# EAGLE schematic MotionDetectorCamera-Rev4 (EAGLE 9.6.2)

## Sheet 1 of 9: VDD
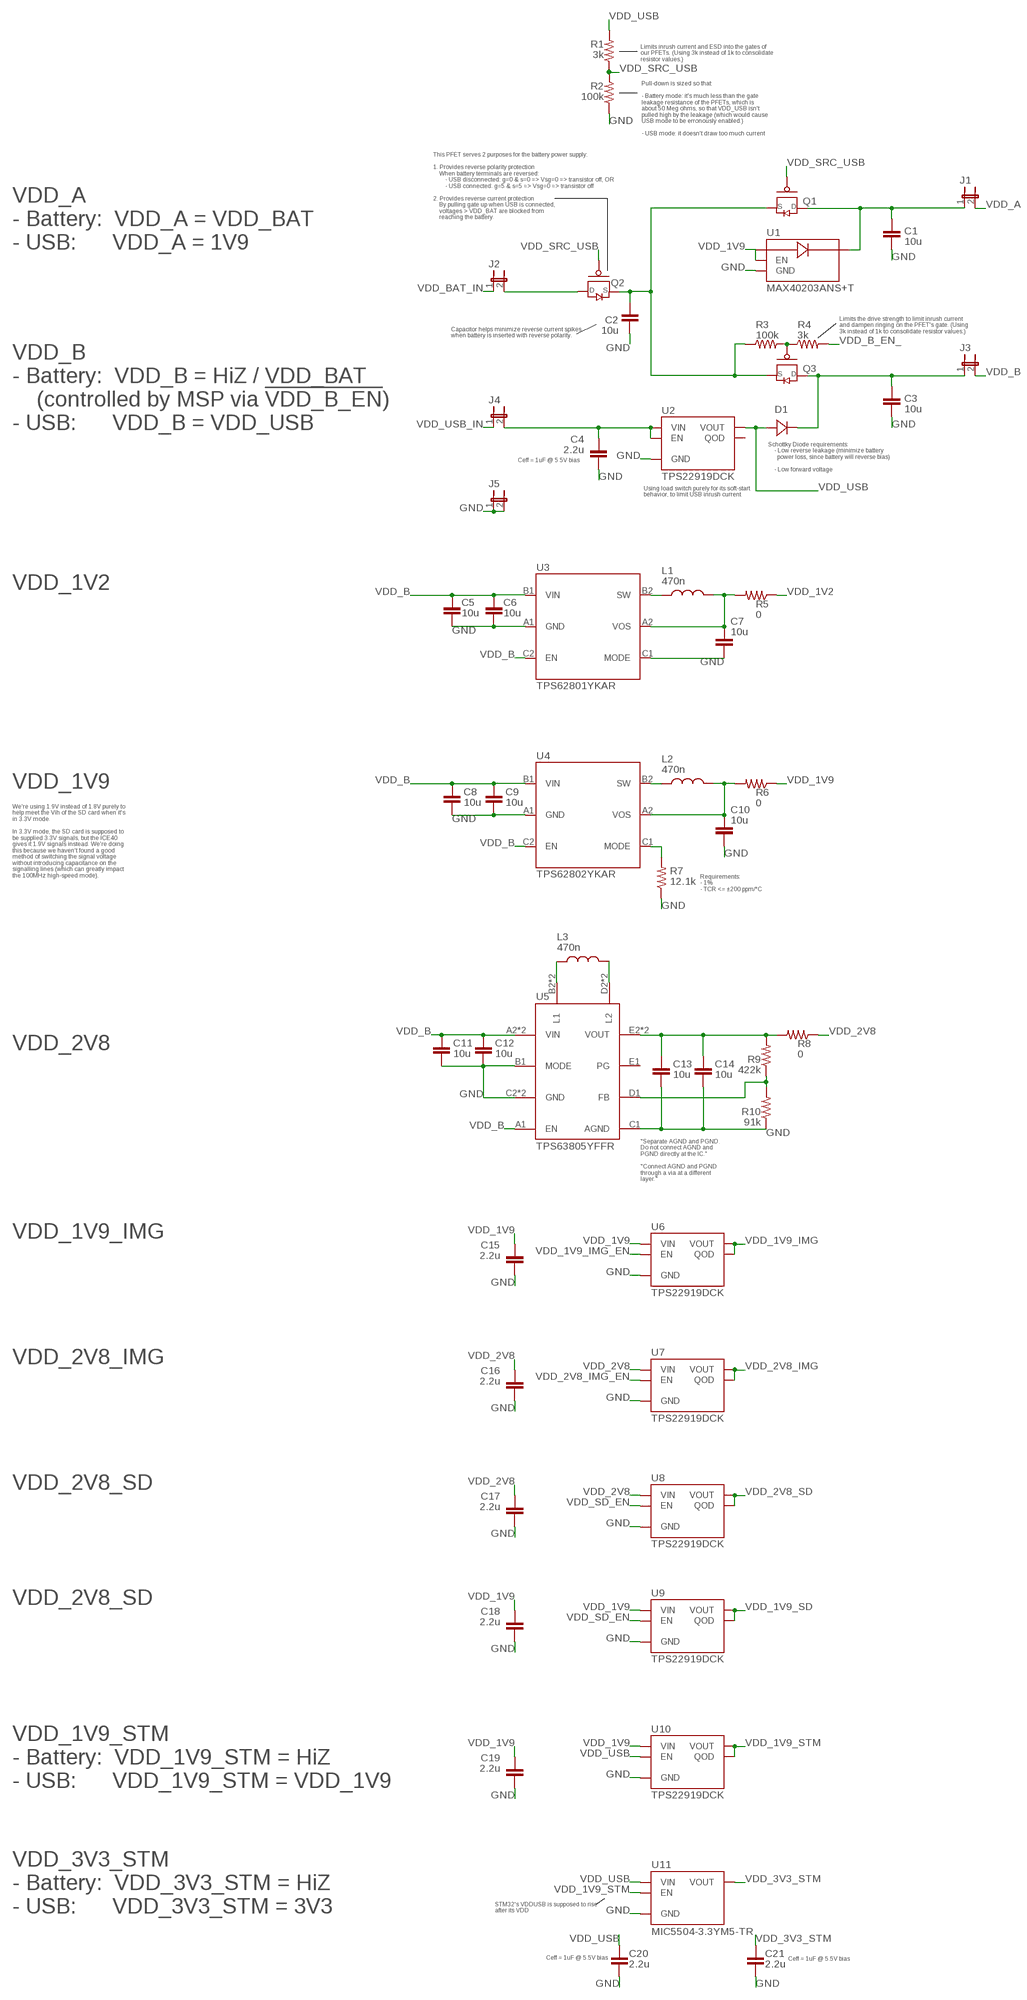
[diagram p0: schematic, sheet 1]

### Parts
C1  10u  CAPACITOR0805  [0805]
C2  10u  CAPACITOR0805  [0805]
C3  10u  CAPACITOR0805  [0805]
C4  2.2u  CAPACITOR0402  [0402]
C5  10u  CAPACITOR0805  [0805]
C6  10u  CAPACITOR0805  [0805]
C7  10u  CAPACITOR0805  [0805]
C8  10u  CAPACITOR0805  [0805]
C9  10u  CAPACITOR0805  [0805]
C10  10u  CAPACITOR0805  [0805]
C11  10u  CAPACITOR0805  [0805]
C12  10u  CAPACITOR0805  [0805]
C13  10u  CAPACITOR0805  [0805]
C14  10u  CAPACITOR0805  [0805]
C15  2.2u  CAPACITOR0402  [0402]
C16  2.2u  CAPACITOR0402  [0402]
C17  2.2u  CAPACITOR0402  [0402]
C18  2.2u  CAPACITOR0402  [0402]
C19  2.2u  CAPACITOR0402  [0402]
C20  2.2u  CAPACITOR0402  [0402]
C21  2.2u  CAPACITOR0402  [0402]
D1  ROHM-RB168MM-40TFTR  [ROHM-RB168MM-40TFTR]
J1  JUMPER  [AMPHENOL-10129380-902002ALF]
J2  JUMPER  [AMPHENOL-10129380-902002ALF]
J3  JUMPER  [AMPHENOL-10129380-902002ALF]
J4  JUMPER  [AMPHENOL-10129380-902002ALF]
J5  JUMPER  [AMPHENOL-10129380-902002ALF]
L1  470n  INDUCTOR0806  [0806]
L2  470n  INDUCTOR0806  [0806]
L3  470n  INDUCTOR0806  [0806]
Q1  PMOS-NEXPERIA-SOT1220  [NEXPERIA-SOT1220]
Q2  PMOS-NEXPERIA-SOT1220  [NEXPERIA-SOT1220]
Q3  PMOS-NEXPERIA-SOT1220  [NEXPERIA-SOT1220]
R1  3k  RESISTOR0402  [0402]
R2  100k  RESISTOR0402  [0402]
R3  100k  RESISTOR0402  [0402]
R4  3k  RESISTOR0402  [0402]
R5  0  RESISTOR0805  [0805]
R6  0  RESISTOR0805  [0805]
R7  12.1k  RESISTOR0402  [0402]
R8  0  RESISTOR0805  [0805]
R9  422k  RESISTOR0402  [0402]
R10  91k  RESISTOR0402  [0402]
U1  MAXIM-MAX40203ANS+T  [MAXIM-MAX40203ANS+T]
U2  TI-TPS22919DCK  [TI-TPS22919DCK]
U3  TI-TPS6280XYKAR  [TI-TPS6280XYKAR]
U4  TI-TPS6280XYKAR  [TI-TPS6280XYKAR]
U5  TI-TPS63805YFFR  [TI-TPS63805YFFR]
U6  TI-TPS22919DCK  [TI-TPS22919DCK]
U7  TI-TPS22919DCK  [TI-TPS22919DCK]
U8  TI-TPS22919DCK  [TI-TPS22919DCK]
U9  TI-TPS22919DCK  [TI-TPS22919DCK]
U10  TI-TPS22919DCK  [TI-TPS22919DCK]
U11  MICROCHIP-MIC550X  [MICROCHIP-MIC550X-SOT23-5]

### Nets
GND: C1.2 C2.2 C3.2 C4.2 C5.2 C6.2 C7.2 C8.2 C9.2 C10.2 C11.2 C12.2 C13.2 C14.2 C15.2 C16.2 C17.2 C18.2 C19.2 C20.2 C21.2 J5.1 J5.2 R2.1 R7.1 R10.1 U1.B2(GND) U2.2(GND) U3.A1(GND) U3.C1(MODE) U4.A1(GND) U5.B1(MODE) U5.C1(AGND) U5.C2(GND) U5.C3(GND) U6.2(GND) U7.2(GND) U8.2(GND) U9.2(GND) U10.2(GND) U11.2(GND) ; also sheet 2,3,4,5,6,7,8,9
N$1: J2.2 Q2.1(D) Q2.2(D) Q2.5(D) Q2.6(D) Q2.7(D)
N$4: L2.1 U4.B2(SW)
N$5: L1.1 U3.B2(SW)
N$6: Q3.3(G) R3.2 R4.1
N$8: C10.1 L2.2 R6.2 U4.A2(VOS)
N$9: C1.1 J1.1 Q1.1(D) Q1.2(D) Q1.5(D) Q1.6(D) Q1.7(D) U1.A2(VOUT)
N$11: R9.1 R10.2 U5.D1(FB)
N$12: L3.1 U5.B2(L1) U5.B3(L1)
N$13: L3.2 U5.D2(L2) U5.D3(L2)
N$15: C3.1 D1.2(C) J3.1 Q3.1(D) Q3.2(D) Q3.5(D) Q3.6(D) Q3.7(D)
N$16: C7.1 L1.2 R5.2 U3.A2(VOS)
N$18: C13.1 C14.1 R8.2 R9.2 U5.E2(VOUT) U5.E3(VOUT)
N$19: C2.1 Q1.4(S) Q1.8(S) Q2.4(S) Q2.8(S) Q3.4(S) Q3.8(S) R3.1
N$21: R7.2 U4.C1(MODE)
N$24: C4.1 J4.2 U2.1(VIN) U2.3(EN)
VDD_1V2: R5.1 ; also sheet 4
VDD_1V9: C15.1 C18.1 C19.1 R6.1 U1.A1(VIN) U1.B1(EN) U6.1(VIN) U9.1(VIN) U10.1(VIN) ; also sheet 2,4,6
VDD_1V9_IMG: U6.5(QOD) U6.6(VOUT) ; also sheet 5
VDD_1V9_IMG_EN: U6.3(EN) ; also sheet 2
VDD_1V9_SD: U9.5(QOD) U9.6(VOUT) ; also sheet 7
VDD_1V9_STM: U10.5(QOD) U10.6(VOUT) U11.3(EN) ; also sheet 8
VDD_2V8: C16.1 C17.1 R8.1 U7.1(VIN) U8.1(VIN) ; also sheet 4
VDD_2V8_IMG: U7.5(QOD) U7.6(VOUT) ; also sheet 5
VDD_2V8_IMG_EN: U7.3(EN) ; also sheet 2
VDD_2V8_SD: U8.5(QOD) U8.6(VOUT) ; also sheet 7
VDD_3V3_STM: C21.1 U11.5(VOUT) ; also sheet 8
VDD_A: J1.2 ; also sheet 2,3
VDD_B: C5.1 C6.1 C8.1 C9.1 C11.1 C12.1 J3.2 U3.B1(VIN) U3.C2(EN) U4.B1(VIN) U4.C2(EN) U5.A1(EN) U5.A2(VIN) U5.A3(VIN)
VDD_B_EN_: R4.2 ; also sheet 2
VDD_BAT_IN: J2.1
VDD_SD_EN: U8.3(EN) U9.3(EN) ; also sheet 2
VDD_SRC_USB: Q1.3(G) Q2.3(G) R1.1 R2.2
VDD_USB: C20.1 D1.1(A) R1.2 U2.6(VOUT) U10.3(EN) U11.1(VIN)
VDD_USB_IN: J4.1 ; also sheet 8,9
Unconnected: U2.5(QOD) U5.E1(PG)

### Notes on the sheet
- Limits inrush current and ESD into the gates of
  our PFETs. (Using 3k instead of 1k to consolidate
  resistor values.)
- Pull-down is sized so that:
  
  - Battery mode: it's much less than the gate
  leakage resistance of the PFETs, which is
  about 50 Meg ohms, so that VDD_USB isn't
  pulled high by the leakage (which would cause
  USB mode to be erronously enabled.)
  
  - USB mode: it doesn't draw too much current
- This PFET serves 2 purposes for the battery power supply:
  
  1. Provides reverse polarity protection
      When battery terminals are reversed:
          - USB disconnected: g=0 & s=0 => Vsg=0 => transistor off, OR
          - USB connected: g=5 & s=5 => Vsg=0 => transistor off
  
  2. Provides reverse current protection
      By pulling gate up when USB is connected,
      voltages > VDD_BAT are blocked from
      reaching the battery.
- VDD_A
  - Battery:  VDD_A = VDD_BAT
  - USB:      VDD_A = 1V9
- Limits the drive strength to limit inrush current
  and dampen ringing on the PFET's gate. (Using
  3k instead of 1k to consolidate resistor values.)
- Capacitor helps minimize reverse current spikes
  when battery is inserted with reverse polarity.
- VDD_B
  - Battery:  VDD_B = HiZ / VDD_BAT
      (controlled by MSP via !VDD_B_EN!)
  - USB:      VDD_B = VDD_USB
- Schottky Diode requirements:
      - Low reverse leakage (minimize battery
        power loss, since battery will reverse bias)
  
      - Low forward voltage
- Ceff = 1uF @ 5.5V bias
- Using load switch purely for its soft-start
  behavior, to limit USB inrush current
- VDD_1V2
- VDD_1V9
- We're using 1.9V instead of 1.8V purely to
  help meet the Vih of the SD card when it's
  in 3.3V mode.
  
  In 3.3V mode, the SD card is supposed to
  be supplied 3.3V signals, but the ICE40
  gives it 1.9V signals instead. We're doing
  this because we haven't found a good
  method of switching the signal voltage
  without introducing capacitance on the
  signalling lines (which can greatly impact
  the 100MHz high-speed mode).
- Requirements:
  - 1%
  - TCR <= ±200 ppm/°C
- VDD_2V8
- "Separate AGND and PGND.
  Do not connect AGND and
  PGND directly at the IC."
  
  "Connect AGND and PGND
  through a via at a different
  layer."
- VDD_1V9_IMG
- VDD_2V8_IMG
- VDD_2V8_SD
- VDD_2V8_SD
- VDD_1V9_STM
  - Battery:  VDD_1V9_STM = HiZ
  - USB:      VDD_1V9_STM = VDD_1V9
- VDD_3V3_STM
  - Battery:  VDD_3V3_STM = HiZ
  - USB:      VDD_3V3_STM = 3V3
- STM32's VDDUSB is supposed to rise
  after its VDD
- Ceff = 1uF @ 5.5V bias | Ceff = 1uF @ 5.5V bias

## Sheet 2 of 9: MSP
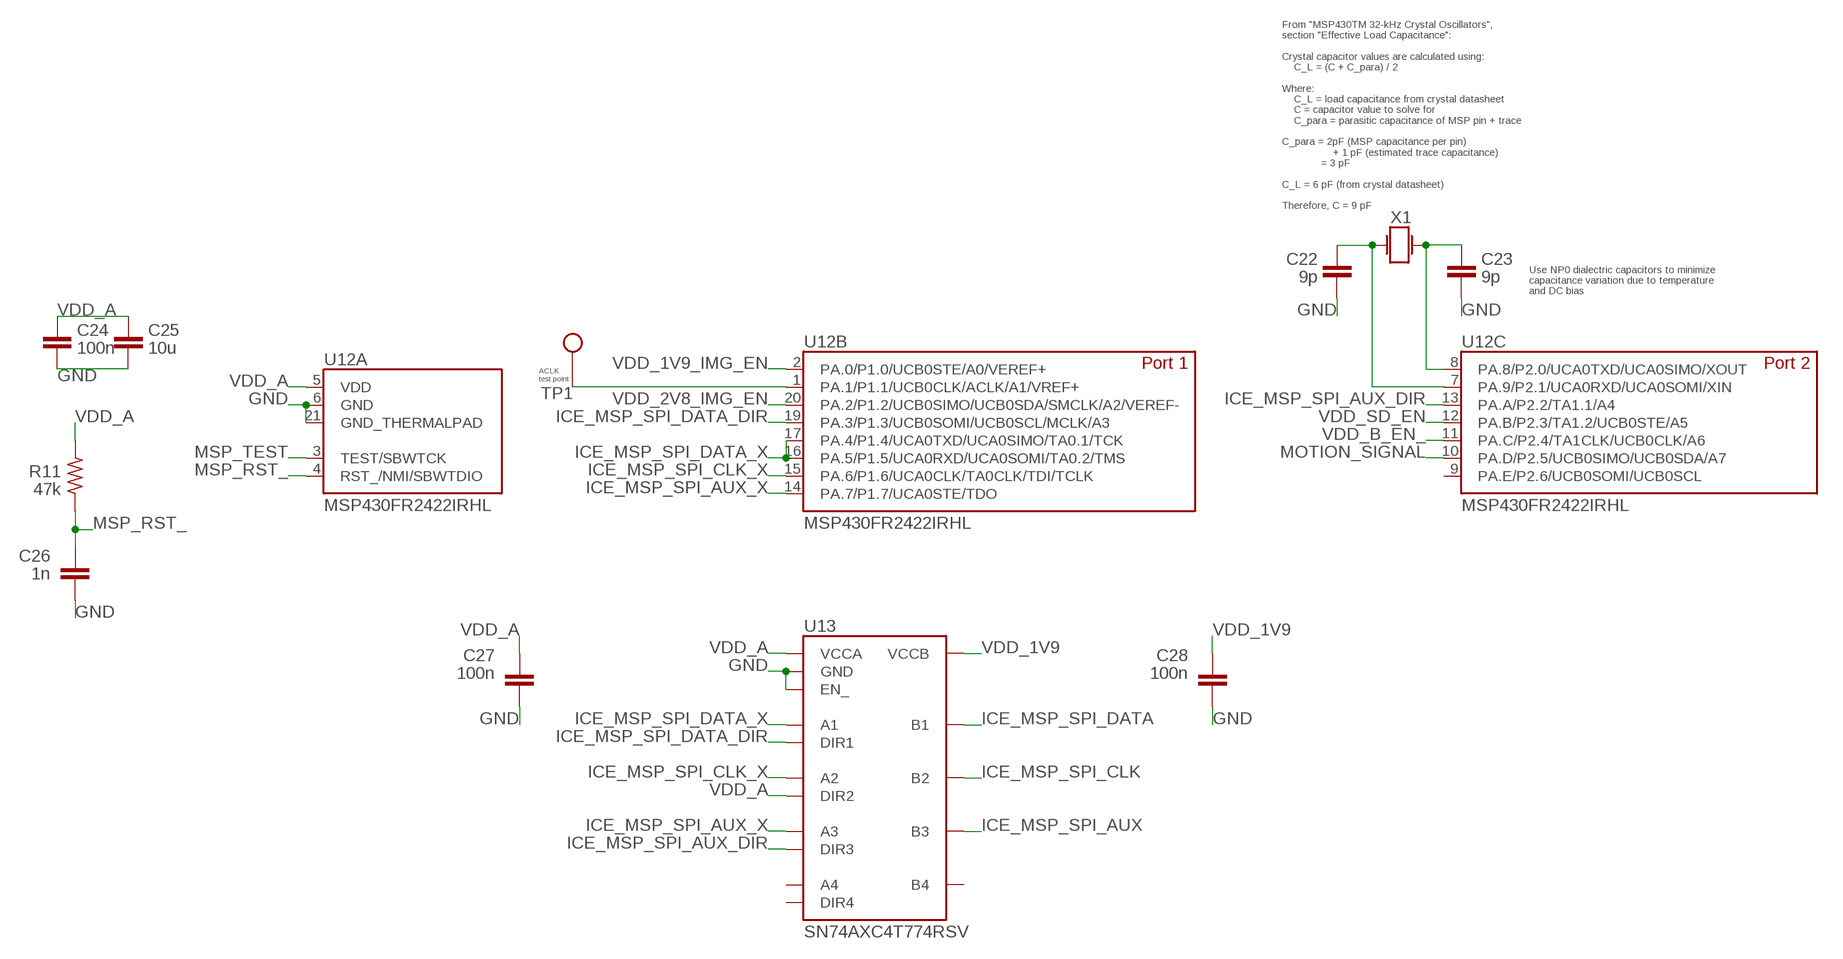
[diagram p1: schematic, sheet 2]

### Parts
C22  9p  CAPACITOR0402  [0402]
C23  9p  CAPACITOR0402  [0402]
C24  100n  CAPACITOR0402  [0402]
C25  10u  CAPACITOR0805  [0805]
C26  1n  CAPACITOR0402  [0402]
C27  100n  CAPACITOR0402  [0402]
C28  100n  CAPACITOR0402  [0402]
R11  47k  RESISTOR0402  [0402]
TP1  TEST-POINT  [TEST-POINT]
U12  TI-MSP430FR2422IRHL  [TI-MSP430FR2422IRHL]
U13  TI-SN74AXC4T774RSV  [TI-SN74AXC4T774RSV]
X1  EPSON-MC-306  [EPSON-MC-306]

### Nets
GND: C22.2 C23.2 C24.2 C25.2 C26.2 C27.2 C28.2 U12.6(A:GND) U12.21(A:GND_THERMALPAD) U13.7(EN_) U13.8(GND) ; also sheet 1,3,4,5,6,7,8,9
ICE_MSP_SPI_AUX: U13.10(B3) ; also sheet 4
ICE_MSP_SPI_AUX_DIR: U12.13(C:PA.A/P2.2/TA1.1/A4) U13.5(DIR3)
ICE_MSP_SPI_AUX_X: U12.14(B:PA.7/P1.7/UCA0STE/TDO) U13.3(A3)
ICE_MSP_SPI_CLK: U13.11(B2) ; also sheet 4
ICE_MSP_SPI_CLK_X: U12.15(B:PA.6/P1.6/UCA0CLK/TA0CLK/TDI/TCLK) U13.2(A2)
ICE_MSP_SPI_DATA: U13.12(B1) ; also sheet 4
ICE_MSP_SPI_DATA_DIR: U12.19(B:PA.3/P1.3/UCB0SOMI/UCB0SCL/MCLK/A3) U13.15(DIR1)
ICE_MSP_SPI_DATA_X: U12.16(B:PA.5/P1.5/UCA0RXD/UCA0SOMI/TA0.2/TMS) U12.17(B:PA.4/P1.4/UCA0TXD/UCA0SIMO/TA0.1/TCK) U13.1(A1)
MOTION_SIGNAL: U12.10(C:PA.D/P2.5/UCB0SIMO/UCB0SDA/A7) ; also sheet 3
MSP_RST_: C26.1 R11.1 U12.4(A:RST_/NMI/SBWTDIO) ; also sheet 8
MSP_TEST: U12.3(A:TEST/SBWTCK) ; also sheet 8
N$14: C23.1 U12.8(C:PA.8/P2.0/UCA0TXD/UCA0SIMO/XOUT) X1.4(B)
N$17: C22.1 U12.7(C:PA.9/P2.1/UCA0RXD/UCA0SOMI/XIN) X1.1(A)
N$22: TP1.X U12.1(B:PA.1/P1.1/UCB0CLK/ACLK/A1/VREF+)
VDD_1V9: C28.1 U13.13(VCCB) ; also sheet 1,4,6
VDD_1V9_IMG_EN: U12.2(B:PA.0/P1.0/UCB0STE/A0/VEREF+) ; also sheet 1
VDD_2V8_IMG_EN: U12.20(B:PA.2/P1.2/UCB0SIMO/UCB0SDA/SMCLK/A2/VEREF-) ; also sheet 1
VDD_A: C24.1 C25.1 C27.1 R11.2 U12.5(A:VDD) U13.14(VCCA) U13.16(DIR2) ; also sheet 1,3
VDD_B_EN_: U12.11(C:PA.C/P2.4/TA1CLK/UCB0CLK/A6) ; also sheet 1
VDD_SD_EN: U12.12(C:PA.B/P2.3/TA1.2/UCB0STE/A5) ; also sheet 1
Unconnected: U12.9(C:PA.E/P2.6/UCB0SOMI/UCB0SCL) U13.4(A4) U13.6(DIR4) U13.9(B4)

### Notes on the sheet
- From "MSP430TM 32-kHz Crystal Oscillators",
  section "Effective Load Capacitance":
  
  Crystal capacitor values are calculated using:
      C_L = (C + C_para) / 2
  
  Where:
      C_L = load capacitance from crystal datasheet
      C = capacitor value to solve for
      C_para = parasitic capacitance of MSP pin + trace
  
  C_para = 2pF (MSP capacitance per pin)
                   + 1 pF (estimated trace capacitance)
               = 3 pF
  
  C_L = 6 pF (from crystal datasheet)
  
  Therefore, C = 9 pF
- Use NP0 dialectric capacitors to minimize
  capacitance variation due to temperature
  and DC bias
- ACLK
  test point

## Sheet 3 of 9: MOTION
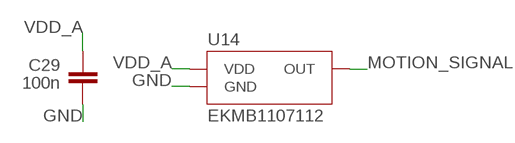
[diagram p2: schematic, sheet 3]

### Parts
C29  100n  CAPACITOR0402  [0402]
U14  PANASONIC-EKMB110711X  [PANASONIC-EKMB110711X]

### Nets
GND: C29.2 U14.3(GND) ; also sheet 1,2,4,5,6,7,8,9
MOTION_SIGNAL: U14.2(OUT) ; also sheet 2
VDD_A: C29.1 U14.1(VDD) ; also sheet 1,2

## Sheet 4 of 9: ICE
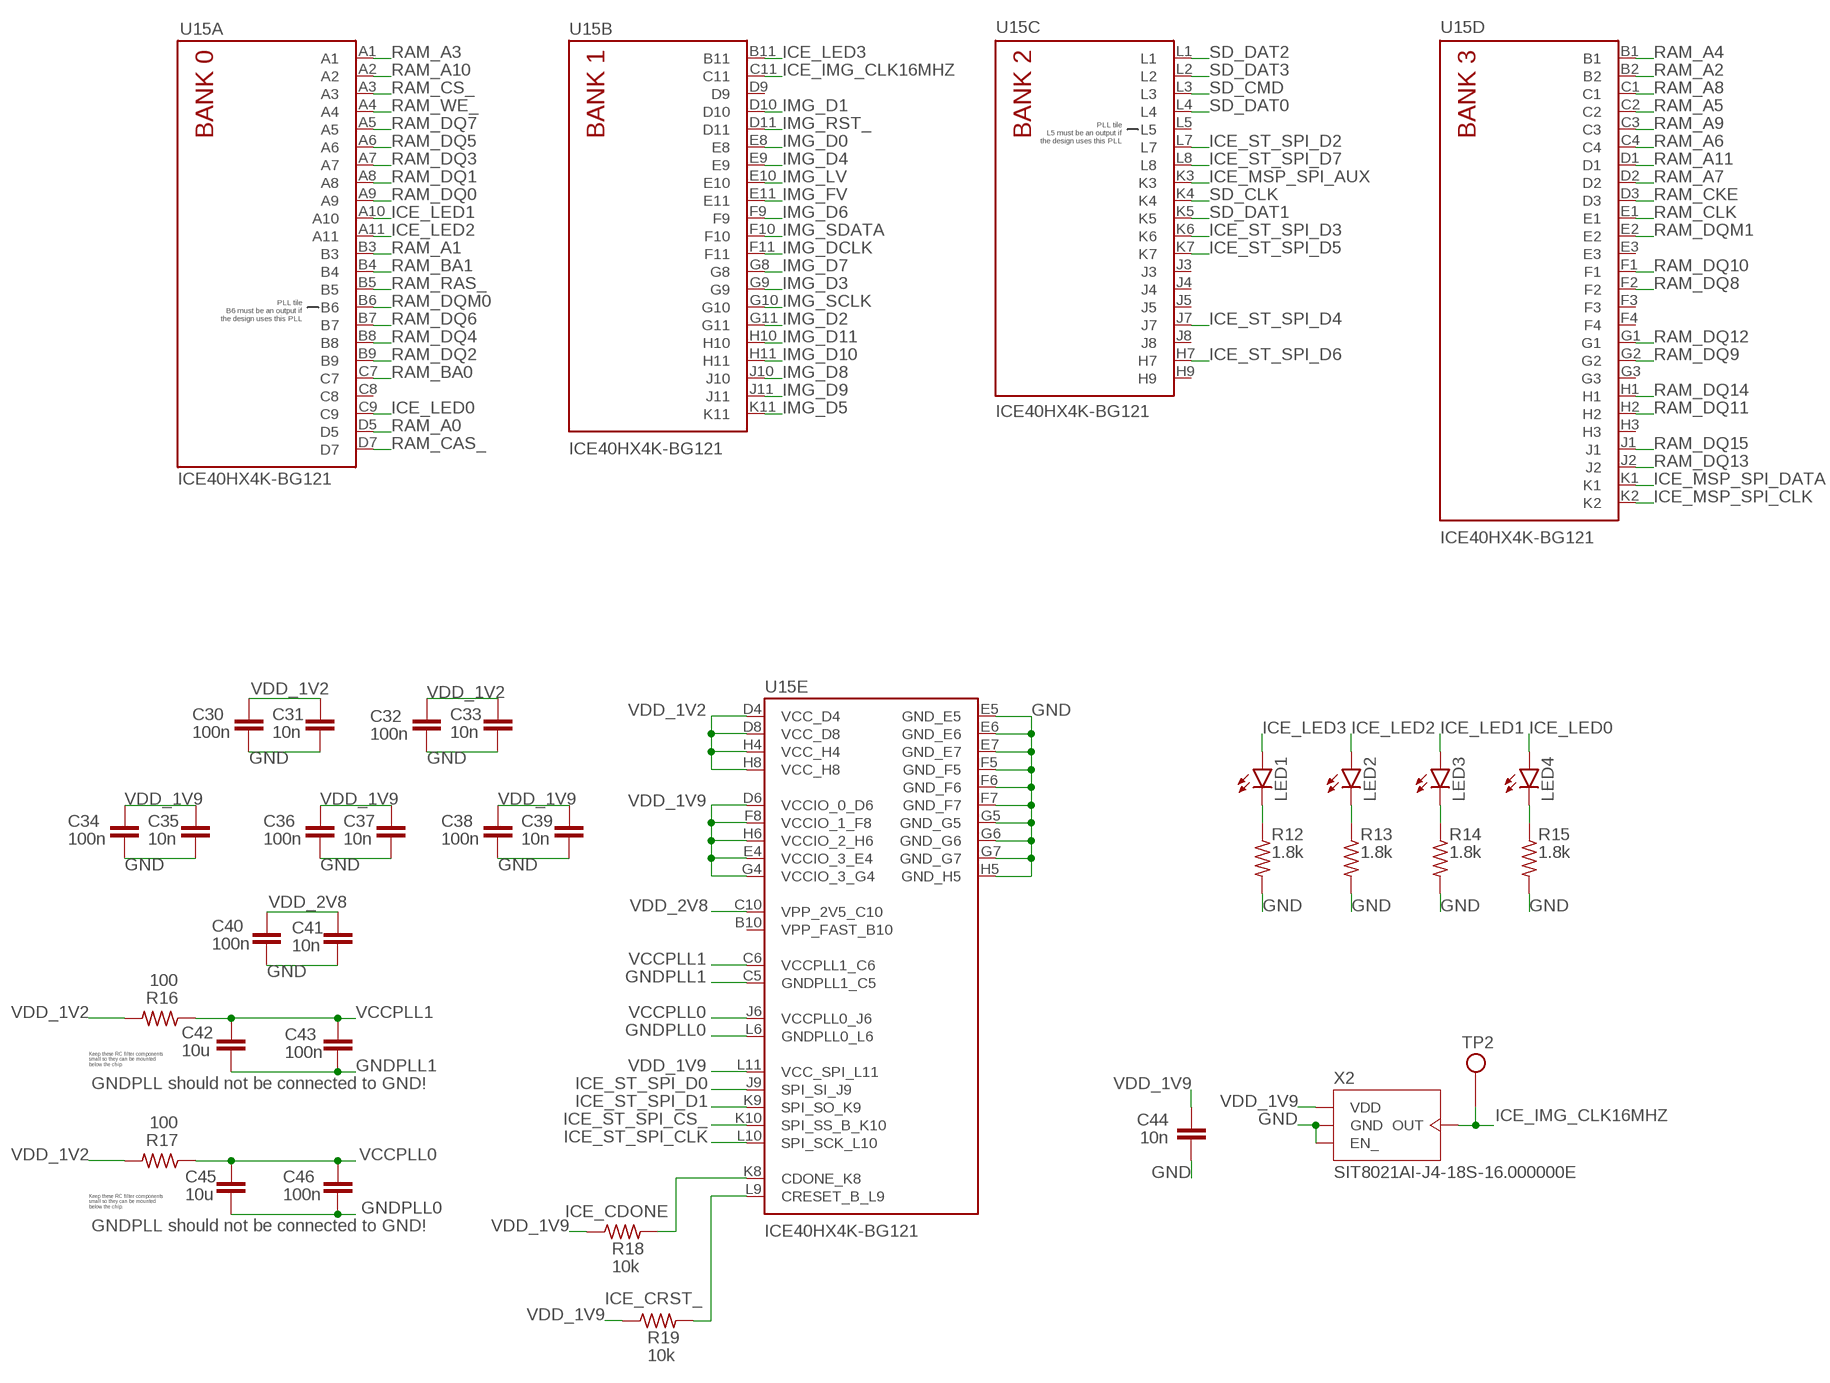
[diagram p3: schematic, sheet 4]

### Parts
C30  100n  CAPACITOR0402  [0402]
C31  10n  CAPACITOR0402  [0402]
C32  100n  CAPACITOR0402  [0402]
C33  10n  CAPACITOR0402  [0402]
C34  100n  CAPACITOR0402  [0402]
C35  10n  CAPACITOR0402  [0402]
C36  100n  CAPACITOR0402  [0402]
C37  10n  CAPACITOR0402  [0402]
C38  100n  CAPACITOR0402  [0402]
C39  10n  CAPACITOR0402  [0402]
C40  100n  CAPACITOR0402  [0402]
C41  10n  CAPACITOR0402  [0402]
C42  10u  CAPACITOR0805  [0805]
C43  100n  CAPACITOR0402  [0402]
C44  10n  CAPACITOR0402  [0402]
C45  10u  CAPACITOR0805  [0805]
C46  100n  CAPACITOR0402  [0402]
LED1  LED  [LED-0603]
LED2  LED  [LED-0603]
LED3  LED  [LED-0603]
LED4  LED  [LED-0603]
R12  1.8k  RESISTOR0402  [0402]
R13  1.8k  RESISTOR0402  [0402]
R14  1.8k  RESISTOR0402  [0402]
R15  1.8k  RESISTOR0402  [0402]
R16  100  RESISTOR0402  [0402]
R17  100  RESISTOR0402  [0402]
R18  10k  RESISTOR0402  [0402]
R19  10k  RESISTOR0402  [0402]
TP2  TEST-POINT  [TEST-POINT]
U15  LATTICE-ICE40HX4K-BG121  [LATTICE-ICE40HX4K-BG121]
X2  SITIME-SIT8021  [SITIME-SIT8021]

### Nets
GND: C30.2 C31.2 C32.2 C33.2 C34.2 C35.2 C36.2 C37.2 C38.2 C39.2 C40.2 C41.2 C44.2 R12.2 R13.2 R14.2 R15.2 U15.E5(E:GND_E5) U15.E6(E:GND_E6) U15.E7(E:GND_E7) U15.F5(E:GND_F5) U15.F6(E:GND_F6) U15.F7(E:GND_F7) U15.G5(E:GND_G5) U15.G6(E:GND_G6) U15.G7(E:GND_G7) U15.H5(E:GND_H5) X2.1(EN_) X2.4(GND) ; also sheet 1,2,3,5,6,7,8,9
GNDPLL0: C45.2 C46.2 U15.L6(E:GNDPLL0_L6)
GNDPLL1: C42.2 C43.2 U15.C5(E:GNDPLL1_C5)
ICE_CDONE: R18.2 U15.K8(E:CDONE_K8) ; also sheet 8
ICE_CRST_: R19.2 U15.L9(E:CRESET_B_L9) ; also sheet 8
ICE_IMG_CLK16MHZ: TP2.X U15.C11(B:C11) X2.2(OUT) ; also sheet 5
ICE_LED0: LED4.A U15.C9(A:C9)
ICE_LED1: LED3.A U15.A10(A:A10)
ICE_LED2: LED2.A U15.A11(A:A11)
ICE_LED3: LED1.A U15.B11(B:B11)
ICE_MSP_SPI_AUX: U15.K3(C:K3) ; also sheet 2
ICE_MSP_SPI_CLK: U15.K2(D:K2) ; also sheet 2
ICE_MSP_SPI_DATA: U15.K1(D:K1) ; also sheet 2
ICE_ST_SPI_CLK: U15.L10(E:SPI_SCK_L10) ; also sheet 8
ICE_ST_SPI_CS_: U15.K10(E:SPI_SS_B_K10) ; also sheet 8
ICE_ST_SPI_D0: U15.J9(E:SPI_SI_J9) ; also sheet 8
ICE_ST_SPI_D1: U15.K9(E:SPI_SO_K9) ; also sheet 8
ICE_ST_SPI_D2: U15.L7(C:L7) ; also sheet 8
ICE_ST_SPI_D3: U15.K6(C:K6) ; also sheet 8
ICE_ST_SPI_D4: U15.J7(C:J7) ; also sheet 8
ICE_ST_SPI_D5: U15.K7(C:K7) ; also sheet 8
ICE_ST_SPI_D6: U15.H7(C:H7) ; also sheet 8
ICE_ST_SPI_D7: U15.L8(C:L8) ; also sheet 8
IMG_D0: U15.E8(B:E8) ; also sheet 5
IMG_D1: U15.D10(B:D10) ; also sheet 5
IMG_D2: U15.G11(B:G11) ; also sheet 5
IMG_D3: U15.G9(B:G9) ; also sheet 5
IMG_D4: U15.E9(B:E9) ; also sheet 5
IMG_D5: U15.K11(B:K11) ; also sheet 5
IMG_D6: U15.F9(B:F9) ; also sheet 5
IMG_D7: U15.G8(B:G8) ; also sheet 5
IMG_D8: U15.J10(B:J10) ; also sheet 5
IMG_D9: U15.J11(B:J11) ; also sheet 5
IMG_D10: U15.H11(B:H11) ; also sheet 5
IMG_D11: U15.H10(B:H10) ; also sheet 5
IMG_DCLK: U15.F11(B:F11) ; also sheet 5
IMG_FV: U15.E11(B:E11) ; also sheet 5
IMG_LV: U15.E10(B:E10) ; also sheet 5
IMG_RST_: U15.D11(B:D11) ; also sheet 5
IMG_SCLK: U15.G10(B:G10) ; also sheet 5
IMG_SDATA: U15.F10(B:F10) ; also sheet 5
N$20: LED3.C R14.1
N$23: LED4.C R15.1
N$26: LED2.C R13.1
N$28: LED1.C R12.1
RAM_A0: U15.D5(A:D5) ; also sheet 6
RAM_A1: U15.B3(A:B3) ; also sheet 6
RAM_A2: U15.B2(D:B2) ; also sheet 6
RAM_A3: U15.A1(A:A1) ; also sheet 6
RAM_A4: U15.B1(D:B1) ; also sheet 6
RAM_A5: U15.C2(D:C2) ; also sheet 6
RAM_A6: U15.C4(D:C4) ; also sheet 6
RAM_A7: U15.D2(D:D2) ; also sheet 6
RAM_A8: U15.C1(D:C1) ; also sheet 6
RAM_A9: U15.C3(D:C3) ; also sheet 6
RAM_A10: U15.A2(A:A2) ; also sheet 6
RAM_A11: U15.D1(D:D1) ; also sheet 6
RAM_BA0: U15.C7(A:C7) ; also sheet 6
RAM_BA1: U15.B4(A:B4) ; also sheet 6
RAM_CAS_: U15.D7(A:D7) ; also sheet 6
RAM_CKE: U15.D3(D:D3) ; also sheet 6
RAM_CLK: U15.E1(D:E1) ; also sheet 6
RAM_CS_: U15.A3(A:A3) ; also sheet 6
RAM_DQ0: U15.A9(A:A9) ; also sheet 6
RAM_DQ1: U15.A8(A:A8) ; also sheet 6
RAM_DQ2: U15.B9(A:B9) ; also sheet 6
RAM_DQ3: U15.A7(A:A7) ; also sheet 6
RAM_DQ4: U15.B8(A:B8) ; also sheet 6
RAM_DQ5: U15.A6(A:A6) ; also sheet 6
RAM_DQ6: U15.B7(A:B7) ; also sheet 6
RAM_DQ7: U15.A5(A:A5) ; also sheet 6
RAM_DQ8: U15.F2(D:F2) ; also sheet 6
RAM_DQ9: U15.G2(D:G2) ; also sheet 6
RAM_DQ10: U15.F1(D:F1) ; also sheet 6
RAM_DQ11: U15.H2(D:H2) ; also sheet 6
RAM_DQ12: U15.G1(D:G1) ; also sheet 6
RAM_DQ13: U15.J2(D:J2) ; also sheet 6
RAM_DQ14: U15.H1(D:H1) ; also sheet 6
RAM_DQ15: U15.J1(D:J1) ; also sheet 6
RAM_DQM0: U15.B6(A:B6) ; also sheet 6
RAM_DQM1: U15.E2(D:E2) ; also sheet 6
RAM_RAS_: U15.B5(A:B5) ; also sheet 6
RAM_WE_: U15.A4(A:A4) ; also sheet 6
SD_CLK: U15.K4(C:K4) ; also sheet 7
SD_CMD: U15.L3(C:L3) ; also sheet 7
SD_DAT0: U15.L4(C:L4) ; also sheet 7
SD_DAT1: U15.K5(C:K5) ; also sheet 7
SD_DAT2: U15.L1(C:L1) ; also sheet 7
SD_DAT3: U15.L2(C:L2) ; also sheet 7
VCCPLL0: C45.1 C46.1 R17.1 U15.J6(E:VCCPLL0_J6)
VCCPLL1: C42.1 C43.1 R16.1 U15.C6(E:VCCPLL1_C6)
VDD_1V2: C30.1 C31.1 C32.1 C33.1 R16.2 R17.2 U15.D4(E:VCC_D4) U15.D8(E:VCC_D8) U15.H4(E:VCC_H4) U15.H8(E:VCC_H8) ; also sheet 1
VDD_1V9: C34.1 C35.1 C36.1 C37.1 C38.1 C39.1 C44.1 R18.1 R19.1 U15.D6(E:VCCIO_0_D6) U15.E4(E:VCCIO_3_E4) U15.F8(E:VCCIO_1_F8) U15.G4(E:VCCIO_3_G4) U15.H6(E:VCCIO_2_H6) U15.L11(E:VCC_SPI_L11) X2.3(VDD) ; also sheet 1,2,6
VDD_2V8: C40.1 C41.1 U15.C10(E:VPP_2V5_C10) ; also sheet 1
Unconnected: U15.B10(E:VPP_FAST_B10) U15.C8(A:C8) U15.D9(B:D9) U15.E3(D:E3) U15.F3(D:F3) U15.F4(D:F4) U15.G3(D:G3) U15.H3(D:H3) U15.H9(C:H9) U15.J3(C:J3) U15.J4(C:J4) U15.J5(C:J5) U15.J8(C:J8) U15.L5(C:L5)

### Notes on the sheet
- Keep these RC filter components
  small so they can be mounted
  below the chip.
- GNDPLL should not be connected to GND!
- Keep these RC filter components
  small so they can be mounted
  below the chip.
- GNDPLL should not be connected to GND!

## Sheet 5 of 9: IMG
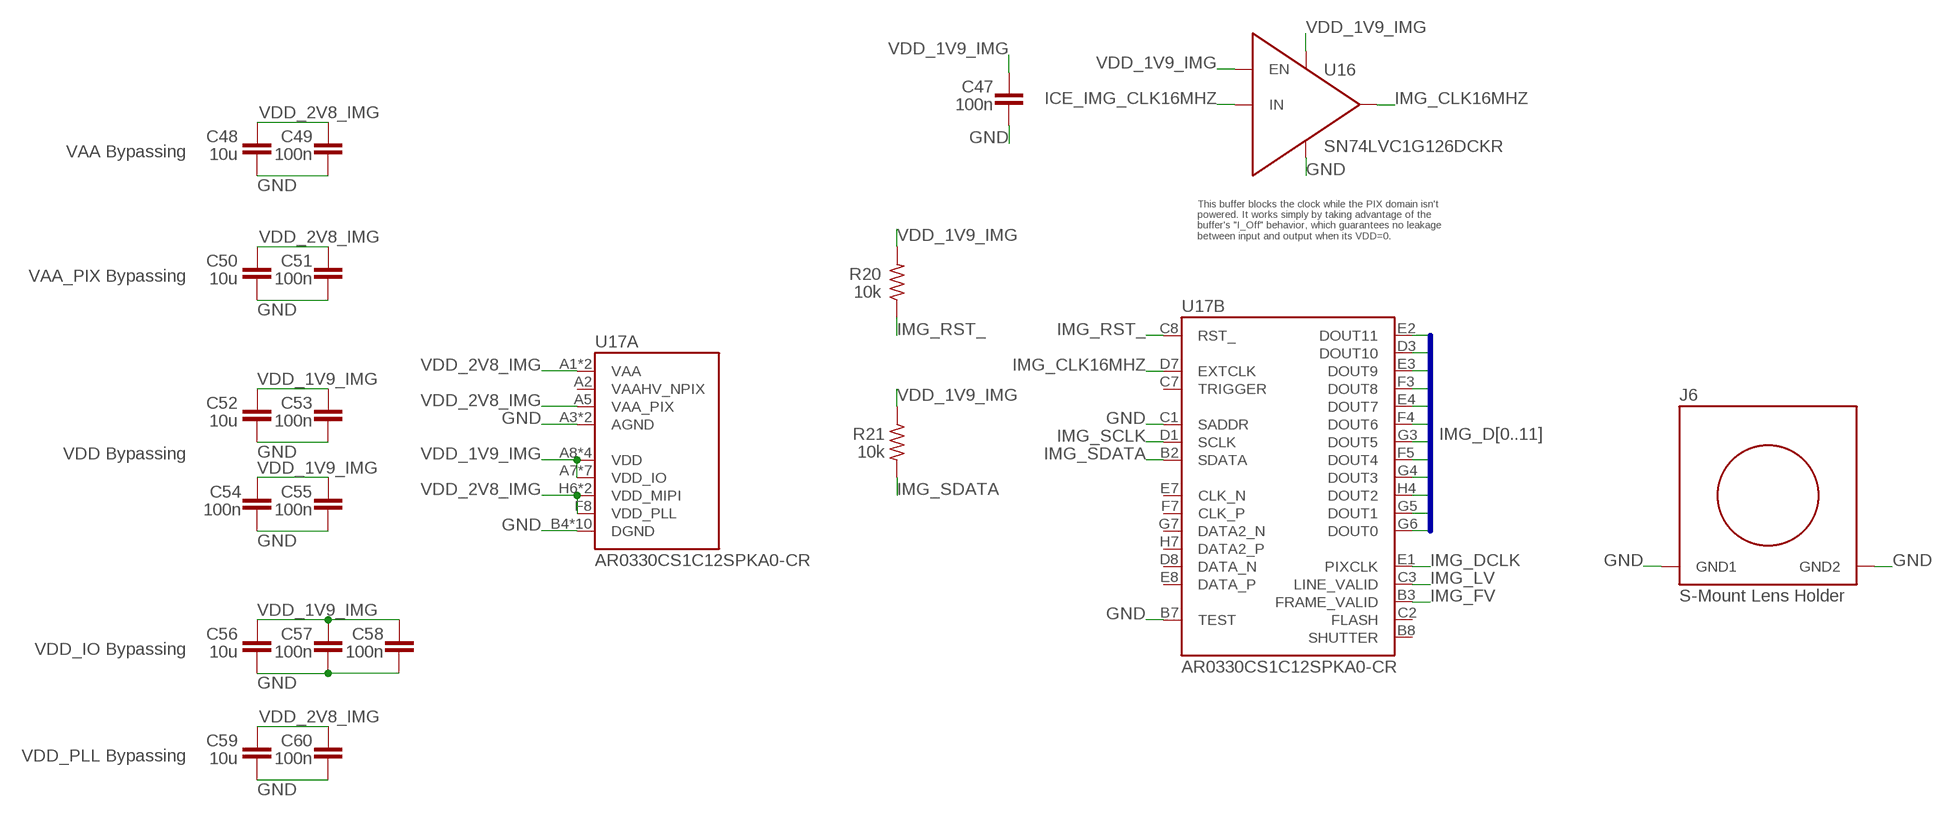
[diagram p4: schematic, sheet 5]

### Parts
C47  100n  CAPACITOR0402  [0402]
C48  10u  CAPACITOR0805  [0805]
C49  100n  CAPACITOR0402  [0402]
C50  10u  CAPACITOR0805  [0805]
C51  100n  CAPACITOR0402  [0402]
C52  10u  CAPACITOR0805  [0805]
C53  100n  CAPACITOR0402  [0402]
C54  100n  CAPACITOR0402  [0402]
C55  100n  CAPACITOR0402  [0402]
C56  10u  CAPACITOR0805  [0805]
C57  100n  CAPACITOR0402  [0402]
C58  100n  CAPACITOR0402  [0402]
C59  10u  CAPACITOR0805  [0805]
C60  100n  CAPACITOR0402  [0402]
J6  S-MOUNT-LENS-HOLDER  [S-MOUNT-LENS-HOLDER]
R20  10k  RESISTOR0402  [0402]
R21  10k  RESISTOR0402  [0402]
U16  TI-SN74LVC1G126  [TI-SN74LVC1G126DCK]
U17  ON-AR0330CS1C12SPKA0  [ON-AR0330CS1C12SPKA0]

### Nets
GND: C47.2 C48.2 C49.2 C50.2 C51.2 C52.2 C53.2 C54.2 C55.2 C56.2 C57.2 C58.2 C59.2 C60.2 J6.1(GND1) J6.2(GND2) U16.3(GND) U17.A3(A:AGND) U17.B4(A:DGND) U17.B5(A:AGND) U17.B6(A:DGND) U17.B7(B:TEST) U17.C1(B:SADDR) U17.C4(A:DGND) U17.C5(A:DGND) U17.C6(A:DGND) U17.D4(A:DGND) U17.E6(A:DGND) U17.G1(A:DGND) U17.H2(A:DGND) U17.H3(A:DGND) ; also sheet 1,2,3,4,6,7,8,9
ICE_IMG_CLK16MHZ: U16.2(IN) ; also sheet 4
IMG_CLK16MHZ: U16.4(OUT) U17.D7(B:EXTCLK)
IMG_D0: U17.G6(B:DOUT0) ; also sheet 4
IMG_D1: U17.G5(B:DOUT1) ; also sheet 4
IMG_D2: U17.H4(B:DOUT2) ; also sheet 4
IMG_D3: U17.G4(B:DOUT3) ; also sheet 4
IMG_D4: U17.F5(B:DOUT4) ; also sheet 4
IMG_D5: U17.G3(B:DOUT5) ; also sheet 4
IMG_D6: U17.F4(B:DOUT6) ; also sheet 4
IMG_D7: U17.E4(B:DOUT7) ; also sheet 4
IMG_D8: U17.F3(B:DOUT8) ; also sheet 4
IMG_D9: U17.E3(B:DOUT9) ; also sheet 4
IMG_D10: U17.D3(B:DOUT10) ; also sheet 4
IMG_D11: U17.E2(B:DOUT11) ; also sheet 4
IMG_DCLK: U17.E1(B:PIXCLK) ; also sheet 4
IMG_FV: U17.B3(B:FRAME_VALID) ; also sheet 4
IMG_LV: U17.C3(B:LINE_VALID) ; also sheet 4
IMG_RST_: R20.1 U17.C8(B:RST_) ; also sheet 4
IMG_SCLK: U17.D1(B:SCLK) ; also sheet 4
IMG_SDATA: R21.2 U17.B2(B:SDATA) ; also sheet 4
VDD_1V9_IMG: C47.1 C52.1 C53.1 C54.1 C55.1 C56.1 C57.1 C58.1 R20.2 R21.1 U16.1(EN) U16.5(VDD) U17.A7(A:VDD_IO) U17.A8(A:VDD) U17.B1(A:VDD) U17.D2(A:VDD_IO) U17.D5(A:VDD_IO) U17.D6(A:VDD_IO) U17.E5(A:VDD_IO) U17.F6(A:VDD_IO) U17.G2(A:VDD) U17.G8(A:VDD) U17.H5(A:VDD_IO) ; also sheet 1
VDD_2V8_IMG: C48.1 C49.1 C50.1 C51.1 C59.1 C60.1 U17.A1(A:VAA) U17.A5(A:VAA_PIX) U17.A6(A:VAA) U17.F8(A:VDD_PLL) U17.H6(A:VDD_MIPI) U17.H8(A:VDD_MIPI) ; also sheet 1
Unconnected: U17.A2(A:VAAHV_NPIX) U17.B8(B:SHUTTER) U17.C2(B:FLASH) U17.C7(B:TRIGGER) U17.D8(B:DATA_N) U17.E7(B:CLK_N) U17.E8(B:DATA_P) U17.F7(B:CLK_P) U17.G7(B:DATA2_N) U17.H7(B:DATA2_P)

### Buses
IMG_D[0..11]

### Notes on the sheet
- VAA Bypassing
- This buffer blocks the clock while the PIX domain isn't
  powered. It works simply by taking advantage of the
  buffer's "I_Off" behavior, which guarantees no leakage
  between input and output when its VDD=0.
- VAA_PIX Bypassing
- VDD Bypassing
- VDD_IO Bypassing
- VDD_PLL Bypassing

## Sheet 6 of 9: RAM
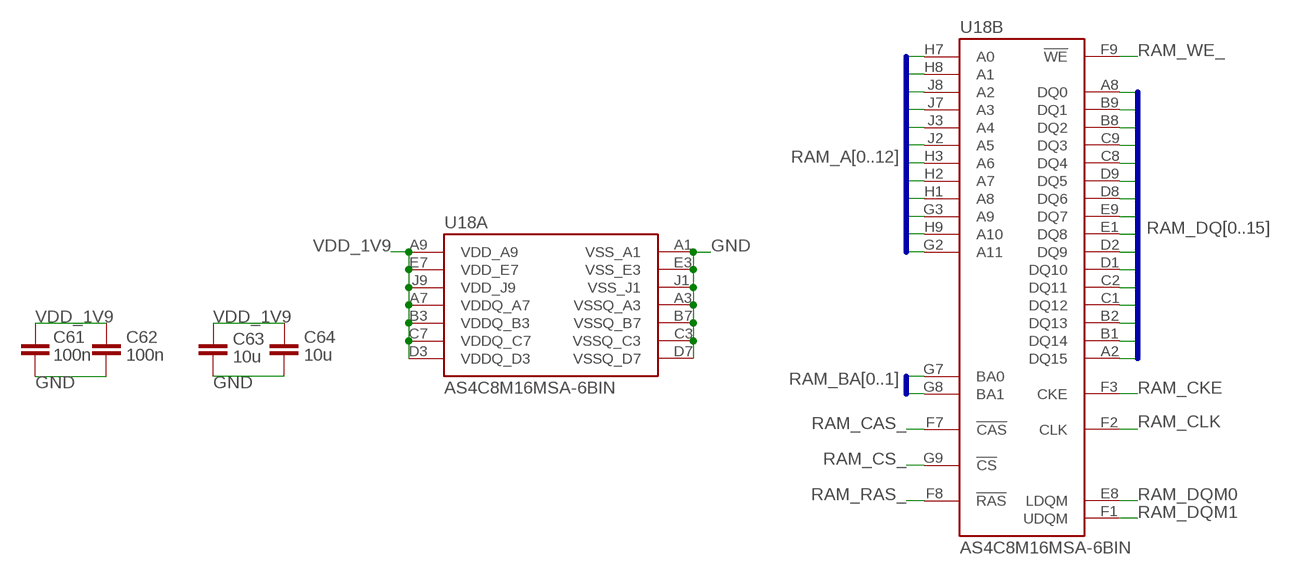
[diagram p5: schematic, sheet 6]

### Parts
C61  100n  CAPACITOR0402  [0402]
C62  100n  CAPACITOR0402  [0402]
C63  10u  CAPACITOR0805  [0805]
C64  10u  CAPACITOR0805  [0805]
U18  ALLIANCE-AS4C8M16MSA-6BIN  [ALLIANCE-AS4C8M16MSA-6BIN]

### Nets
GND: C61.2 C62.2 C63.2 C64.2 U18.A1(A:VSS_A1) U18.A3(A:VSSQ_A3) U18.B7(A:VSSQ_B7) U18.C3(A:VSSQ_C3) U18.D7(A:VSSQ_D7) U18.E3(A:VSS_E3) U18.J1(A:VSS_J1) ; also sheet 1,2,3,4,5,7,8,9
RAM_A0: U18.H7(B:A0) ; also sheet 4
RAM_A1: U18.H8(B:A1) ; also sheet 4
RAM_A2: U18.J8(B:A2) ; also sheet 4
RAM_A3: U18.J7(B:A3) ; also sheet 4
RAM_A4: U18.J3(B:A4) ; also sheet 4
RAM_A5: U18.J2(B:A5) ; also sheet 4
RAM_A6: U18.H3(B:A6) ; also sheet 4
RAM_A7: U18.H2(B:A7) ; also sheet 4
RAM_A8: U18.H1(B:A8) ; also sheet 4
RAM_A9: U18.G3(B:A9) ; also sheet 4
RAM_A10: U18.H9(B:A10) ; also sheet 4
RAM_A11: U18.G2(B:A11) ; also sheet 4
RAM_BA0: U18.G7(B:BA0) ; also sheet 4
RAM_BA1: U18.G8(B:BA1) ; also sheet 4
RAM_CAS_: U18.F7(B:!CAS!) ; also sheet 4
RAM_CKE: U18.F3(B:CKE) ; also sheet 4
RAM_CLK: U18.F2(B:CLK) ; also sheet 4
RAM_CS_: U18.G9(B:!CS!) ; also sheet 4
RAM_DQ0: U18.A8(B:DQ0) ; also sheet 4
RAM_DQ1: U18.B9(B:DQ1) ; also sheet 4
RAM_DQ2: U18.B8(B:DQ2) ; also sheet 4
RAM_DQ3: U18.C9(B:DQ3) ; also sheet 4
RAM_DQ4: U18.C8(B:DQ4) ; also sheet 4
RAM_DQ5: U18.D9(B:DQ5) ; also sheet 4
RAM_DQ6: U18.D8(B:DQ6) ; also sheet 4
RAM_DQ7: U18.E9(B:DQ7) ; also sheet 4
RAM_DQ8: U18.E1(B:DQ8) ; also sheet 4
RAM_DQ9: U18.D2(B:DQ9) ; also sheet 4
RAM_DQ10: U18.D1(B:DQ10) ; also sheet 4
RAM_DQ11: U18.C2(B:DQ11) ; also sheet 4
RAM_DQ12: U18.C1(B:DQ12) ; also sheet 4
RAM_DQ13: U18.B2(B:DQ13) ; also sheet 4
RAM_DQ14: U18.B1(B:DQ14) ; also sheet 4
RAM_DQ15: U18.A2(B:DQ15) ; also sheet 4
RAM_DQM0: U18.E8(B:LDQM) ; also sheet 4
RAM_DQM1: U18.F1(B:UDQM) ; also sheet 4
RAM_RAS_: U18.F8(B:!RAS!) ; also sheet 4
RAM_WE_: U18.F9(B:!WE!) ; also sheet 4
VDD_1V9: C61.1 C62.1 C63.1 C64.1 U18.A7(A:VDDQ_A7) U18.A9(A:VDD_A9) U18.B3(A:VDDQ_B3) U18.C7(A:VDDQ_C7) U18.D3(A:VDDQ_D3) U18.E7(A:VDD_E7) U18.J9(A:VDD_J9) ; also sheet 1,2,4

### Buses
RAM_A[0..12]
RAM_DQ[0..15]
RAM_BA[0..1]

## Sheet 7 of 9: SD
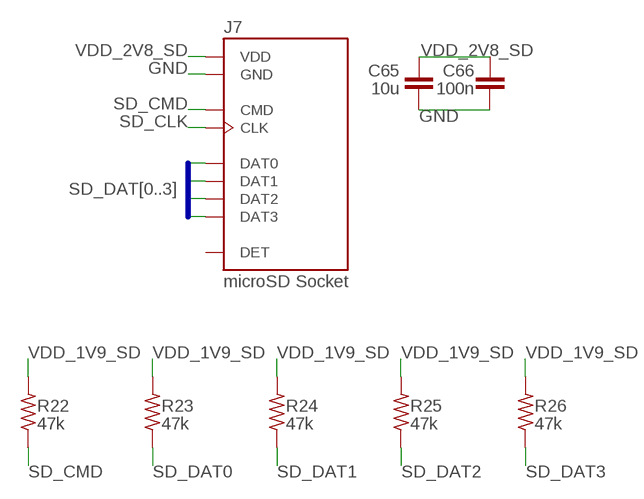
[diagram p6: schematic, sheet 7]

### Parts
C65  10u  CAPACITOR0805  [0805]
C66  100n  CAPACITOR0402  [0402]
J7  MICROSD-SOCKET  [MOLEX-1051620001]
R22  47k  RESISTOR0402  [0402]
R23  47k  RESISTOR0402  [0402]
R24  47k  RESISTOR0402  [0402]
R25  47k  RESISTOR0402  [0402]
R26  47k  RESISTOR0402  [0402]

### Nets
GND: C65.2 C66.2 J7.GND1(GND) J7.GND2(GND) J7.GND3(GND) J7.GND4(GND) J7.VSS(GND) ; also sheet 1,2,3,4,5,6,8,9
SD_CLK: J7.CLK ; also sheet 4
SD_CMD: J7.CMD R22.1 ; also sheet 4
SD_DAT0: J7.DAT0 R23.1 ; also sheet 4
SD_DAT1: J7.DAT1 R24.1 ; also sheet 4
SD_DAT2: J7.DAT2 R25.1 ; also sheet 4
SD_DAT3: J7.DAT3 R26.1 ; also sheet 4
VDD_1V9_SD: R22.2 R23.2 R24.2 R25.2 R26.2 ; also sheet 1
VDD_2V8_SD: C65.1 C66.1 J7.VDD ; also sheet 1
Unconnected: J7.DET

### Buses
SD_DAT[0..3]

## Sheet 8 of 9: STM
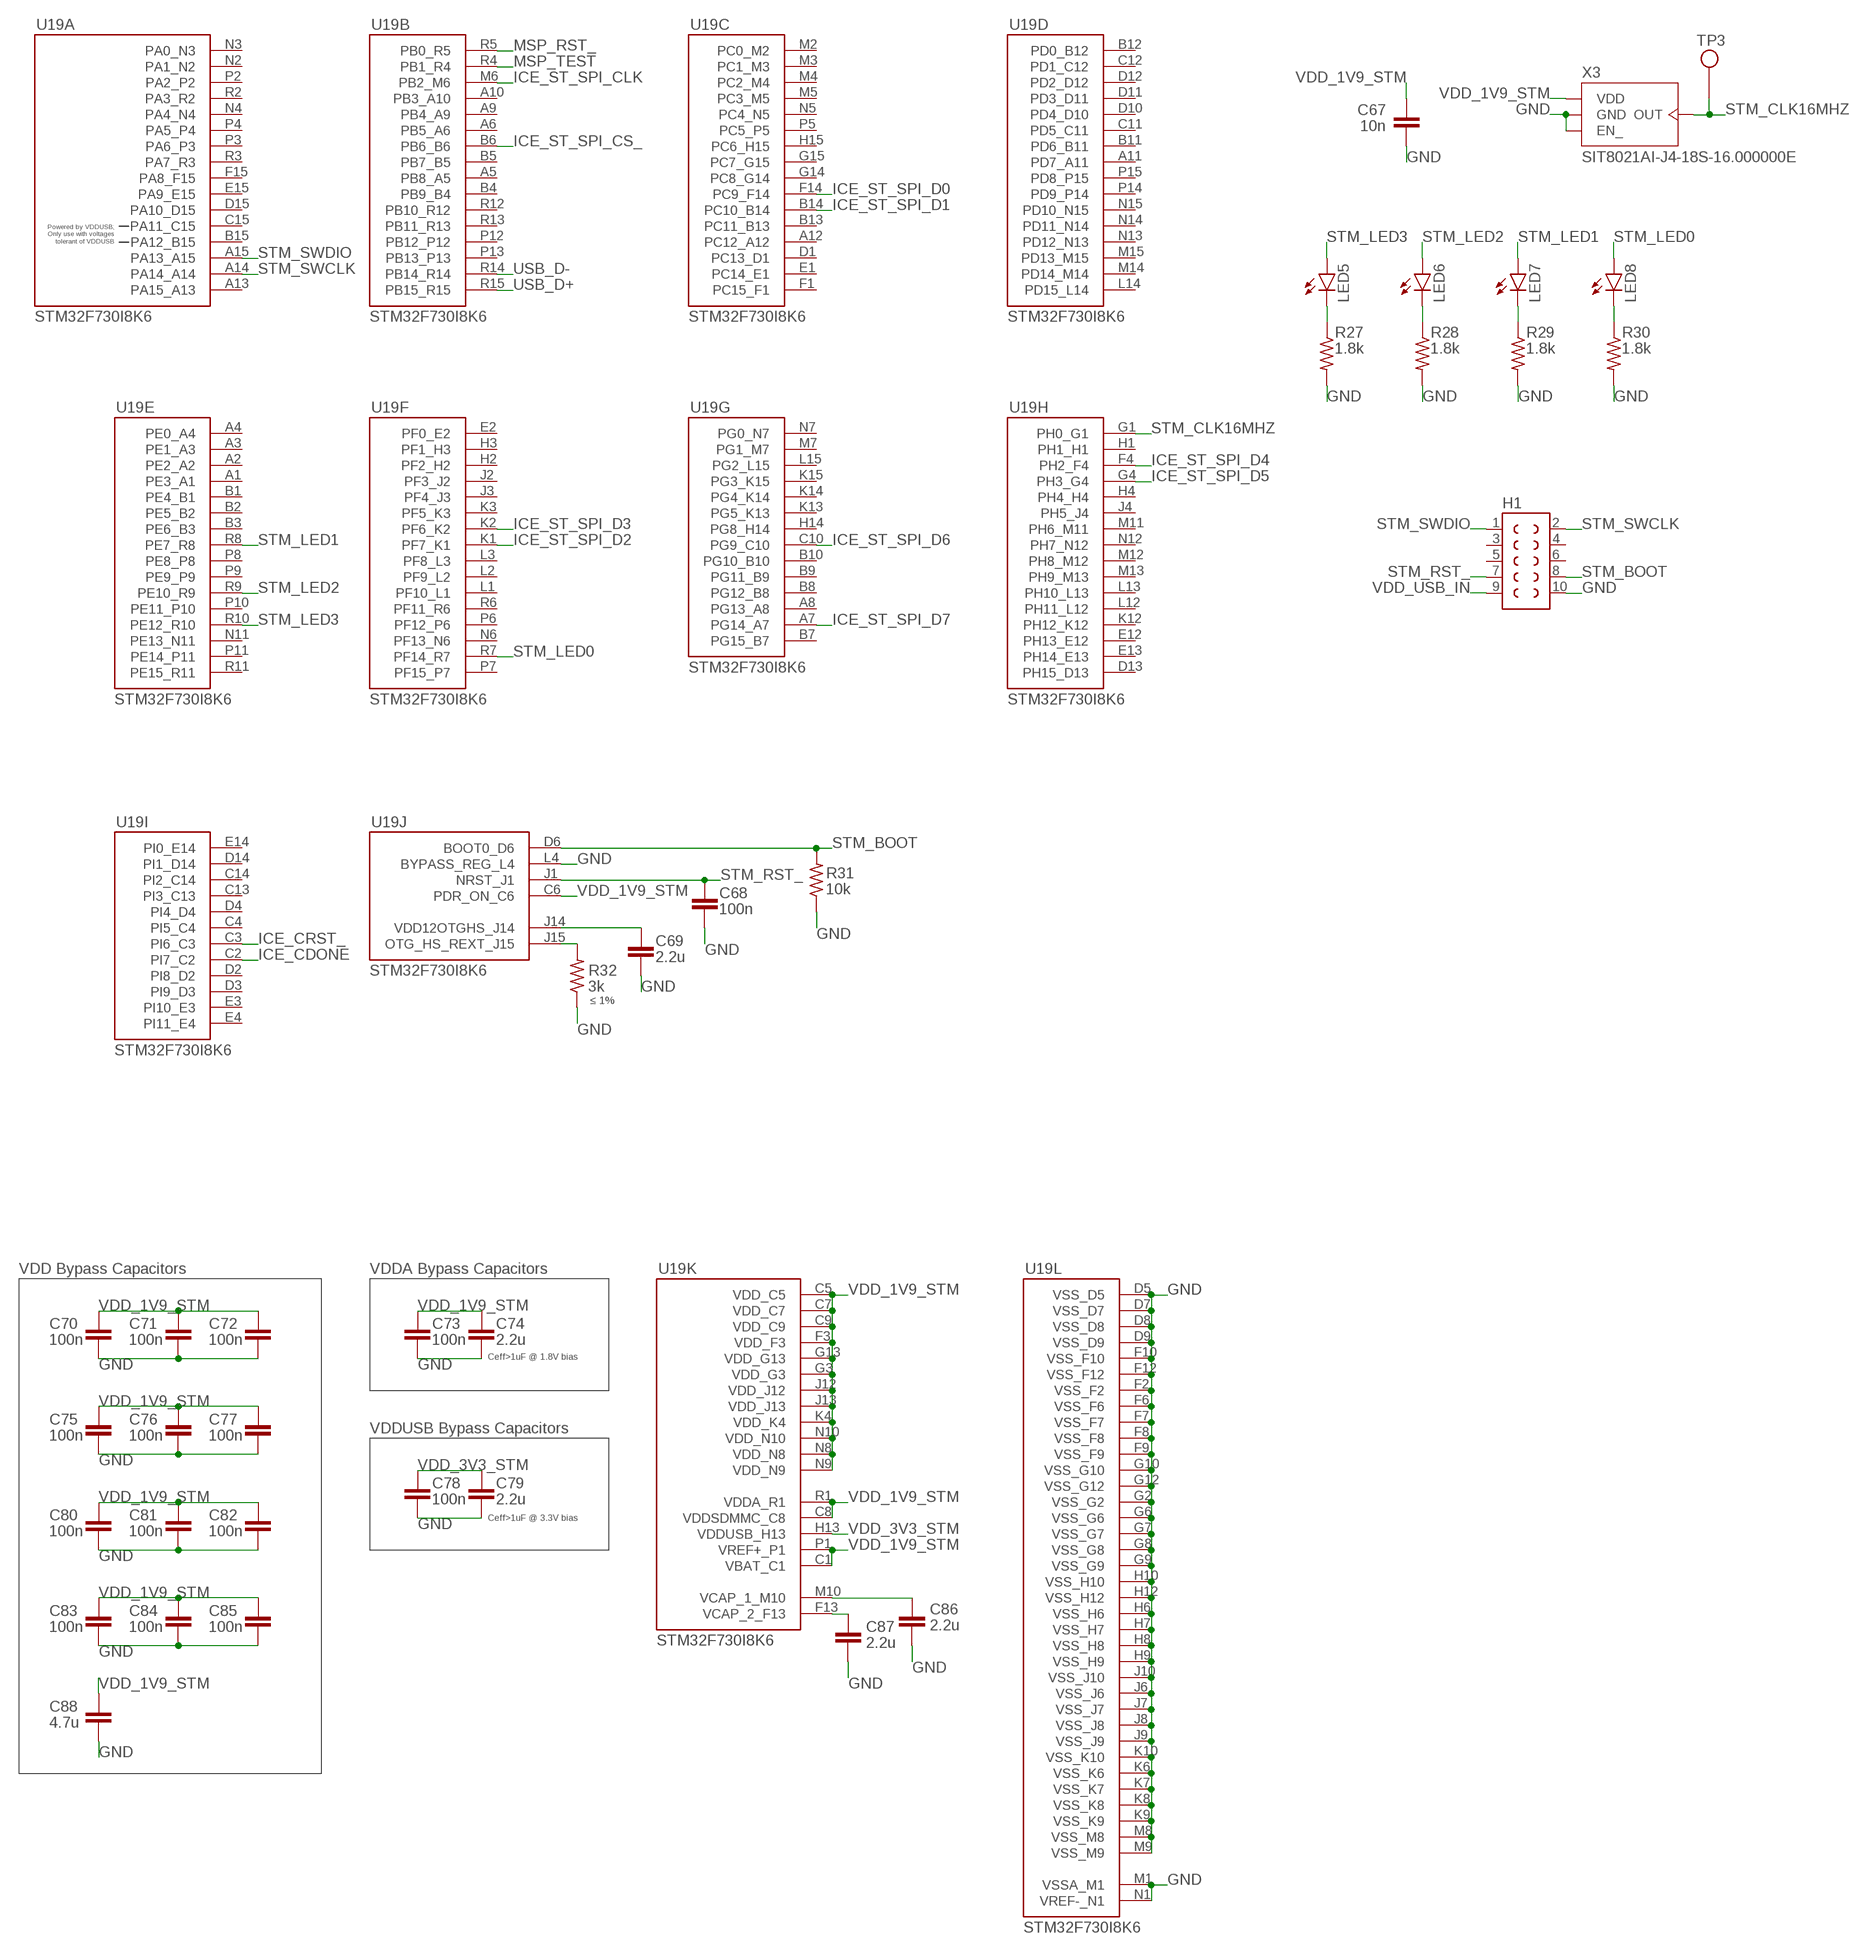
[diagram p7: schematic, sheet 8]

### Parts
C67  10n  CAPACITOR0402  [0402]
C68  100n  CAPACITOR0402  [0402]
C69  2.2u  CAPACITOR0402  [0402]
C70  100n  CAPACITOR0402  [0402]
C71  100n  CAPACITOR0402  [0402]
C72  100n  CAPACITOR0402  [0402]
C73  100n  CAPACITOR0402  [0402]
C74  2.2u  CAPACITOR0402  [0402]
C75  100n  CAPACITOR0402  [0402]
C76  100n  CAPACITOR0402  [0402]
C77  100n  CAPACITOR0402  [0402]
C78  100n  CAPACITOR0402  [0402]
C79  2.2u  CAPACITOR0402  [0402]
C80  100n  CAPACITOR0402  [0402]
C81  100n  CAPACITOR0402  [0402]
C82  100n  CAPACITOR0402  [0402]
C83  100n  CAPACITOR0402  [0402]
C84  100n  CAPACITOR0402  [0402]
C85  100n  CAPACITOR0402  [0402]
C86  2.2u  CAPACITOR0402  [0402]
C87  2.2u  CAPACITOR0402  [0402]
C88  4.7u  CAPACITOR0603  [0603]
H1  HEADER-2X5  [TEC-1-2314844-0]
LED5  LED  [LED-0603]
LED6  LED  [LED-0603]
LED7  LED  [LED-0603]
LED8  LED  [LED-0603]
R27  1.8k  RESISTOR0402  [0402]
R28  1.8k  RESISTOR0402  [0402]
R29  1.8k  RESISTOR0402  [0402]
R30  1.8k  RESISTOR0402  [0402]
R31  10k  RESISTOR0402  [0402]
R32  3k  RESISTOR0402  [0402]
TP3  TEST-POINT  [TEST-POINT]
U19  STM-STM32F730  [STM-STM32F730I8]
X3  SITIME-SIT8021  [SITIME-SIT8021]

### Nets
GND: C67.2 C68.2 C69.2 C70.2 C71.2 C72.2 C73.2 C74.2 C75.2 C76.2 C77.2 C78.2 C79.2 C80.2 C81.2 C82.2 C83.2 C84.2 C85.2 C86.2 C87.2 C88.2 H1.10 R27.2 R28.2 R29.2 R30.2 R31.1 R32.1 U19.D5(L:VSS_D5) U19.D7(L:VSS_D7) U19.D8(L:VSS_D8) U19.D9(L:VSS_D9) U19.F2(L:VSS_F2) U19.F6(L:VSS_F6) U19.F7(L:VSS_F7) U19.F8(L:VSS_F8) U19.F9(L:VSS_F9) U19.F10(L:VSS_F10) U19.F12(L:VSS_F12) U19.G2(L:VSS_G2) U19.G6(L:VSS_G6) U19.G7(L:VSS_G7) U19.G8(L:VSS_G8) U19.G9(L:VSS_G9) U19.G10(L:VSS_G10) U19.G12(L:VSS_G12) U19.H6(L:VSS_H6) U19.H7(L:VSS_H7) U19.H8(L:VSS_H8) U19.H9(L:VSS_H9) U19.H10(L:VSS_H10) U19.H12(L:VSS_H12) U19.J6(L:VSS_J6) U19.J7(L:VSS_J7) U19.J8(L:VSS_J8) U19.J9(L:VSS_J9) U19.J10(L:VSS_J10) U19.K6(L:VSS_K6) U19.K7(L:VSS_K7) U19.K8(L:VSS_K8) U19.K9(L:VSS_K9) U19.K10(L:VSS_K10) U19.L4(J:BYPASS_REG_L4) U19.M1(L:VSSA_M1) U19.M8(L:VSS_M8) U19.M9(L:VSS_M9) U19.N1(L:VREF-_N1) X3.1(EN_) X3.4(GND) ; also sheet 1,2,3,4,5,6,7,9
ICE_CDONE: U19.C2(I:PI7_C2) ; also sheet 4
ICE_CRST_: U19.C3(I:PI6_C3) ; also sheet 4
ICE_ST_SPI_CLK: U19.M6(B:PB2_M6) ; also sheet 4
ICE_ST_SPI_CS_: U19.B6(B:PB6_B6) ; also sheet 4
ICE_ST_SPI_D0: U19.F14(C:PC9_F14) ; also sheet 4
ICE_ST_SPI_D1: U19.B14(C:PC10_B14) ; also sheet 4
ICE_ST_SPI_D2: U19.K1(F:PF7_K1) ; also sheet 4
ICE_ST_SPI_D3: U19.K2(F:PF6_K2) ; also sheet 4
ICE_ST_SPI_D4: U19.F4(H:PH2_F4) ; also sheet 4
ICE_ST_SPI_D5: U19.G4(H:PH3_G4) ; also sheet 4
ICE_ST_SPI_D6: U19.C10(G:PG9_C10) ; also sheet 4
ICE_ST_SPI_D7: U19.A7(G:PG14_A7) ; also sheet 4
MSP_RST_: U19.R5(B:PB0_R5) ; also sheet 2
MSP_TEST: U19.R4(B:PB1_R4) ; also sheet 2
N$2: C86.1 U19.M10(K:VCAP_1_M10)
N$7: C87.1 U19.F13(K:VCAP_2_F13)
N$10: R32.2 U19.J15(J:OTG_HS_REXT_J15)
N$25: C69.1 U19.J14(J:VDD12OTGHS_J14)
N$27: LED8.C R30.1
N$29: LED7.C R29.1
N$30: LED6.C R28.1
N$31: LED5.C R27.1
STM_BOOT: H1.8 R31.2 U19.D6(J:BOOT0_D6)
STM_CLK16MHZ: TP3.X U19.G1(H:PH0_G1) X3.2(OUT)
STM_LED0: LED8.A U19.R7(F:PF14_R7)
STM_LED1: LED7.A U19.R8(E:PE7_R8)
STM_LED2: LED6.A U19.R9(E:PE10_R9)
STM_LED3: LED5.A U19.R10(E:PE12_R10)
STM_RST_: C68.1 H1.7 U19.J1(J:NRST_J1)
STM_SWCLK: H1.2 U19.A14(A:PA14_A14)
STM_SWDIO: H1.1 U19.A15(A:PA13_A15)
USB_D+: U19.R15(B:PB15_R15) ; also sheet 9
USB_D-: U19.R14(B:PB14_R14) ; also sheet 9
VDD_1V9_STM: C67.1 C70.1 C71.1 C72.1 C73.1 C74.1 C75.1 C76.1 C77.1 C80.1 C81.1 C82.1 C83.1 C84.1 C85.1 C88.1 U19.C1(K:VBAT_C1) U19.C5(K:VDD_C5) U19.C6(J:PDR_ON_C6) U19.C7(K:VDD_C7) U19.C8(K:VDDSDMMC_C8) U19.C9(K:VDD_C9) U19.F3(K:VDD_F3) U19.G3(K:VDD_G3) U19.G13(K:VDD_G13) U19.J12(K:VDD_J12) U19.J13(K:VDD_J13) U19.K4(K:VDD_K4) U19.N8(K:VDD_N8) U19.N9(K:VDD_N9) U19.N10(K:VDD_N10) U19.P1(K:VREF+_P1) U19.R1(K:VDDA_R1) X3.3(VDD) ; also sheet 1
VDD_3V3_STM: C78.1 C79.1 U19.H13(K:VDDUSB_H13) ; also sheet 1
VDD_USB_IN: H1.9 ; also sheet 1,9
Unconnected: H1.3 H1.4 H1.5 H1.6 U19.A1(E:PE3_A1) U19.A2(E:PE2_A2) U19.A3(E:PE1_A3) U19.A4(E:PE0_A4) U19.A5(B:PB8_A5) U19.A6(B:PB5_A6) U19.A8(G:PG13_A8) U19.A9(B:PB4_A9) U19.A10(B:PB3_A10) U19.A11(D:PD7_A11) U19.A12(C:PC12_A12) U19.A13(A:PA15_A13) U19.B1(E:PE4_B1) U19.B2(E:PE5_B2) U19.B3(E:PE6_B3) U19.B4(B:PB9_B4) U19.B5(B:PB7_B5) U19.B7(G:PG15_B7) U19.B8(G:PG12_B8) U19.B9(G:PG11_B9) U19.B10(G:PG10_B10) U19.B11(D:PD6_B11) U19.B12(D:PD0_B12) U19.B13(C:PC11_B13) U19.B15(A:PA12_B15) U19.C4(I:PI5_C4) U19.C11(D:PD5_C11) U19.C12(D:PD1_C12) U19.C13(I:PI3_C13) U19.C14(I:PI2_C14) U19.C15(A:PA11_C15) U19.D1(C:PC13_D1) U19.D2(I:PI8_D2) U19.D3(I:PI9_D3) U19.D4(I:PI4_D4) U19.D10(D:PD4_D10) U19.D11(D:PD3_D11) U19.D12(D:PD2_D12) U19.D13(H:PH15_D13) U19.D14(I:PI1_D14) U19.D15(A:PA10_D15) U19.E1(C:PC14_E1) U19.E2(F:PF0_E2) U19.E3(I:PI10_E3) U19.E4(I:PI11_E4) U19.E12(H:PH13_E12) U19.E13(H:PH14_E13) U19.E14(I:PI0_E14) U19.E15(A:PA9_E15) U19.F1(C:PC15_F1) U19.F15(A:PA8_F15) U19.G14(C:PC8_G14) U19.G15(C:PC7_G15) U19.H1(H:PH1_H1) U19.H2(F:PF2_H2) U19.H3(F:PF1_H3) U19.H4(H:PH4_H4) U19.H14(G:PG8_H14) U19.H15(C:PC6_H15) U19.J2(F:PF3_J2) U19.J3(F:PF4_J3) U19.J4(H:PH5_J4) U19.K3(F:PF5_K3) U19.K12(H:PH12_K12) U19.K13(G:PG5_K13) U19.K14(G:PG4_K14) U19.K15(G:PG3_K15) U19.L1(F:PF10_L1) U19.L2(F:PF9_L2) U19.L3(F:PF8_L3) U19.L12(H:PH11_L12) U19.L13(H:PH10_L13) U19.L14(D:PD15_L14) U19.L15(G:PG2_L15) U19.M2(C:PC0_M2) U19.M3(C:PC1_M3) U19.M4(C:PC2_M4) U19.M5(C:PC3_M5) U19.M7(G:PG1_M7) U19.M11(H:PH6_M11) U19.M12(H:PH8_M12) U19.M13(H:PH9_M13) U19.M14(D:PD14_M14) U19.M15(D:PD13_M15) U19.N2(A:PA1_N2) U19.N3(A:PA0_N3) U19.N4(A:PA4_N4) U19.N5(C:PC4_N5) U19.N6(F:PF13_N6) U19.N7(G:PG0_N7) U19.N11(E:PE13_N11) U19.N12(H:PH7_N12) U19.N13(D:PD12_N13) U19.N14(D:PD11_N14) U19.N15(D:PD10_N15) U19.P2(A:PA2_P2) U19.P3(A:PA6_P3) U19.P4(A:PA5_P4) U19.P5(C:PC5_P5) U19.P6(F:PF12_P6) U19.P7(F:PF15_P7) U19.P8(E:PE8_P8) U19.P9(E:PE9_P9) U19.P10(E:PE11_P10) U19.P11(E:PE14_P11) U19.P12(B:PB12_P12) U19.P13(B:PB13_P13) U19.P14(D:PD9_P14) U19.P15(D:PD8_P15) U19.R2(A:PA3_R2) U19.R3(A:PA7_R3) U19.R6(F:PF11_R6) U19.R11(E:PE15_R11) U19.R12(B:PB10_R12) U19.R13(B:PB11_R13)

### Notes on the sheet
- ≤ 1%
- VDD Bypass Capacitors | VDDA Bypass Capacitors
- Ceff>1uF @ 1.8V bias
- VDDUSB Bypass Capacitors
- Ceff>1uF @ 3.3V bias

## Sheet 9 of 9: USB
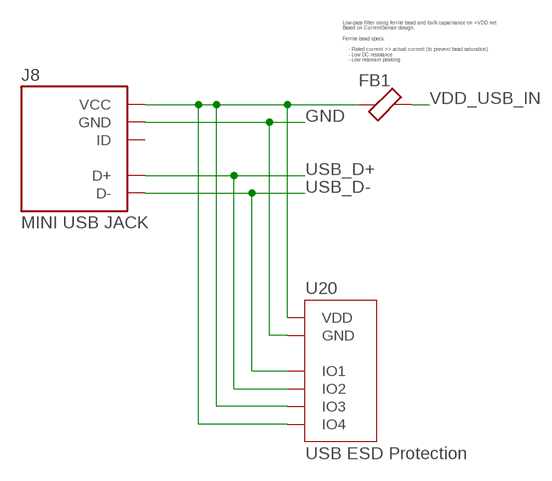
[diagram p8: schematic, sheet 9]

### Parts
FB1  FERRITE-BEAD0402  [0402]
J8  MINI-USB-JACK  [AMPHENOL-10033526-N3222MLF]
U20  DIODESINC-DT1446-04V-7  [DIODESINC-DT1446-04V-7]

### Nets
GND: J8.GND J8.GND2(GND) J8.GND3(GND) J8.GND4(GND) J8.GND5(GND) U20.2(GND) ; also sheet 1,2,3,4,5,6,7,8
N$54: FB1.1 J8.VCC U20.4(IO3) U20.5(VDD) U20.6(IO4)
USB_D+: J8.D+ U20.3(IO2) ; also sheet 8
USB_D-: J8.D- U20.1(IO1) ; also sheet 8
VDD_USB_IN: FB1.2 ; also sheet 1,8
Unconnected: J8.ID

### Notes on the sheet
- Low-pass filter using ferrite bead and bulk capacitance on +VDD net.
  Based on CurrentSensor design.
  
  Ferrite bead specs:
  
      - Rated current >> actual current (to prevent bead saturation)
      - Low DC resistance
      - Low resonant peaking

## Library data of the parts
C1-C3 C5-C14 C25 C42 C45 C48 C50 C52 C56 C59 C63-C65 = EagleLibrary:CAPACITOR; MFG: Samsung; PN: CL21A106KOQNNNE
C4 C15-C21 C69 C74 C79 C86 C87 = EagleLibrary:CAPACITOR; MFG: Taiyo Yuden; PN: TMK105CBJ225KV-F
C22 C23 = EagleLibrary:CAPACITOR; MFG: Yageo; PN: CC0402BRNPO9BN9R0
C24 C27-C30 C32 C34 C36 C38 C40 C43 C46 C47 C49 C51 C53-C55 C57 C58 C60-C62 C66 C68 C70-C73 C75-C78 C80-C85 = EagleLibrary:CAPACITOR; MFG: Murata; PN: GRM155R61H104KE19D
C26 = EagleLibrary:CAPACITOR; MFG: Yageo; PN: CC0402MRX7R9BB102
C31 C33 C35 C37 C39 C41 C44 C67 = EagleLibrary:CAPACITOR; MFG: Samsung; PN: CL05B103KB5NNNC
C88 = EagleLibrary:CAPACITOR; MFG: Taiyo Yuden; PN: LMK107BJ475KA-T
D1 = EagleLibrary:ROHM-RB168MM-40TFTR; MFG: ROHM; PN: RB168MM-40TFTR
FB1 = EagleLibrary:FERRITE-BEAD; MFG: Taiyo Yuden; PN: BKP1005EM100-T
H1 = EagleLibrary:HEADER-2X5; MFG: TE Connectivity; PN: 1-2314844-0
J1-J5 = EagleLibrary:JUMPER; MFG: Amphenol; PN: 10129380-902002ALF
J6 = EagleLibrary:S-MOUNT-LENS-HOLDER; MFG: Marshall Electronics; PN: V-LH4
J7 = EagleLibrary:MICROSD-SOCKET: microSD Socket; MFG: Molex; PN: 105162-0001
J8 = EagleLibrary:MINI-USB-JACK: Mini USB Jack; MFG: Amphenol FCI; PN: 10033526-N3222MLF
L1-L3 = EagleLibrary:INDUCTOR; MFG: Murata; PN: DFE201612E-R47M=P2
LED1-LED8 = EagleLibrary:LED: LED; MFG: OSRAM; PN: KS DELLS1.22-JHKI-1
Q1-Q3 = EagleLibrary:PMOS: PMOS MOSFET transistor; MFG: Nexperia; PN: PMPB10UPX
R1 R4 R32 = EagleLibrary:RESISTOR; MFG: Yageo; PN: AC0402FR-073KL
R2 R3 = EagleLibrary:RESISTOR; MFG: Yageo; PN: RC0402FR-10100KL
R5 R6 R8 = EagleLibrary:RESISTOR; MFG: Yageo; PN: RC0805JR-070RL
R7 = EagleLibrary:RESISTOR; MFG: Walsin; PN: WR04X1212FTL
R9 = EagleLibrary:RESISTOR; MFG: Bourns; PN: CR0402-FX-4223GLF
R10 = EagleLibrary:RESISTOR; MFG: Bourns; PN: CR0402-FX-9102GLF
R11 R22-R26 = EagleLibrary:RESISTOR; MFG: Walsin; PN: WR04X473 JTL
R12-R15 R27-R30 = EagleLibrary:RESISTOR; MFG: TE Connectivity; PN: CRGP0402F1K8
R16 R17 = EagleLibrary:RESISTOR; MFG: Bourns; PN: CR0402AJW-101GAS
R18-R21 R31 = EagleLibrary:RESISTOR; MFG: Yageo; PN: RC0402JR-0710KL
TP1-TP3 = EagleLibrary:TEST-POINT: Bare copper test point
U1 = EagleLibrary:MAXIM-MAX40203ANS+T; MFG: Maxim Integrated; PN: MAX40203ANS+T
U2 U6-U10 = EagleLibrary:TI-TPS22919DCK; MFG: Texas Instruments; PN: TPS22919DCK
U3 = EagleLibrary:TI-TPS6280XYKAR: Step-Down Converter; MFG: Texas Instruments; PN: TPS62801YKAR
U4 = EagleLibrary:TI-TPS6280XYKAR: Step-Down Converter; MFG: Texas Instruments; PN: TPS62802YKAR
U5 = EagleLibrary:TI-TPS63805YFFR: Buck-Boost Converter; MFG: Texas Instruments; PN: TPS63805YFFR
U11 = EagleLibrary:MICROCHIP-MIC550X; MFG: Microchip; PN: MIC5504-3.3YM5-TR
U12 = EagleLibrary:TI-MSP430FR2422IRHL; MFG: Texas Instruments; PN: MSP430FR2422IRHL
U13 = EagleLibrary:TI-SN74AXC4T774RSV; MFG: Texas Instruments; PN: SN74AXC4T774RSV
U14 = EagleLibrary:PANASONIC-EKMB110711X: Motion sensor; MFG: Panasonic; PN: EKMB1107112
U15 = EagleLibrary:LATTICE-ICE40HX4K-BG121: Lattice ICE40 FPGA; MFG: Lattice; PN: ICE40HX4K-BG121
U16 = EagleLibrary:TI-SN74LVC1G126; MFG: Texas Instruments; PN: SN74LVC1G126DCKR
U17 = EagleLibrary:ON-AR0330CS1C12SPKA0: 3.4 Megapixel CMOS Image Sensor; MFG: ON Semiconductor; PN: AR0330CS1C12SPKA0-CR
U18 = EagleLibrary:ALLIANCE-AS4C8M16MSA-6BIN: 128M Low Power SDRAM; MFG: Alliance Memory; PN: AS4C8M16MSA-6BIN
U19 = EagleLibrary:STM-STM32F730; MFG: STMicroelectronics; PN: STM32F730I8K6
U20 = EagleLibrary:DIODESINC-DT1446-04V-7; MFG: Diodes Incorporated; PN: DT1446-04V-7
X1 = EagleLibrary:EPSON-MC-306; MFG: Epson; PN: MC-306 32.7680K-E3:ROHS
X2 X3 = EagleLibrary:SITIME-SIT8021: MEMS Oscillator; MFG: SiTime; PN: SIT8021AI-J4-18S-16.000000E